# Altium schematic sheet Amplifiers.SchDoc
size A4; SheetNumber: 4; SheetTotal: 4
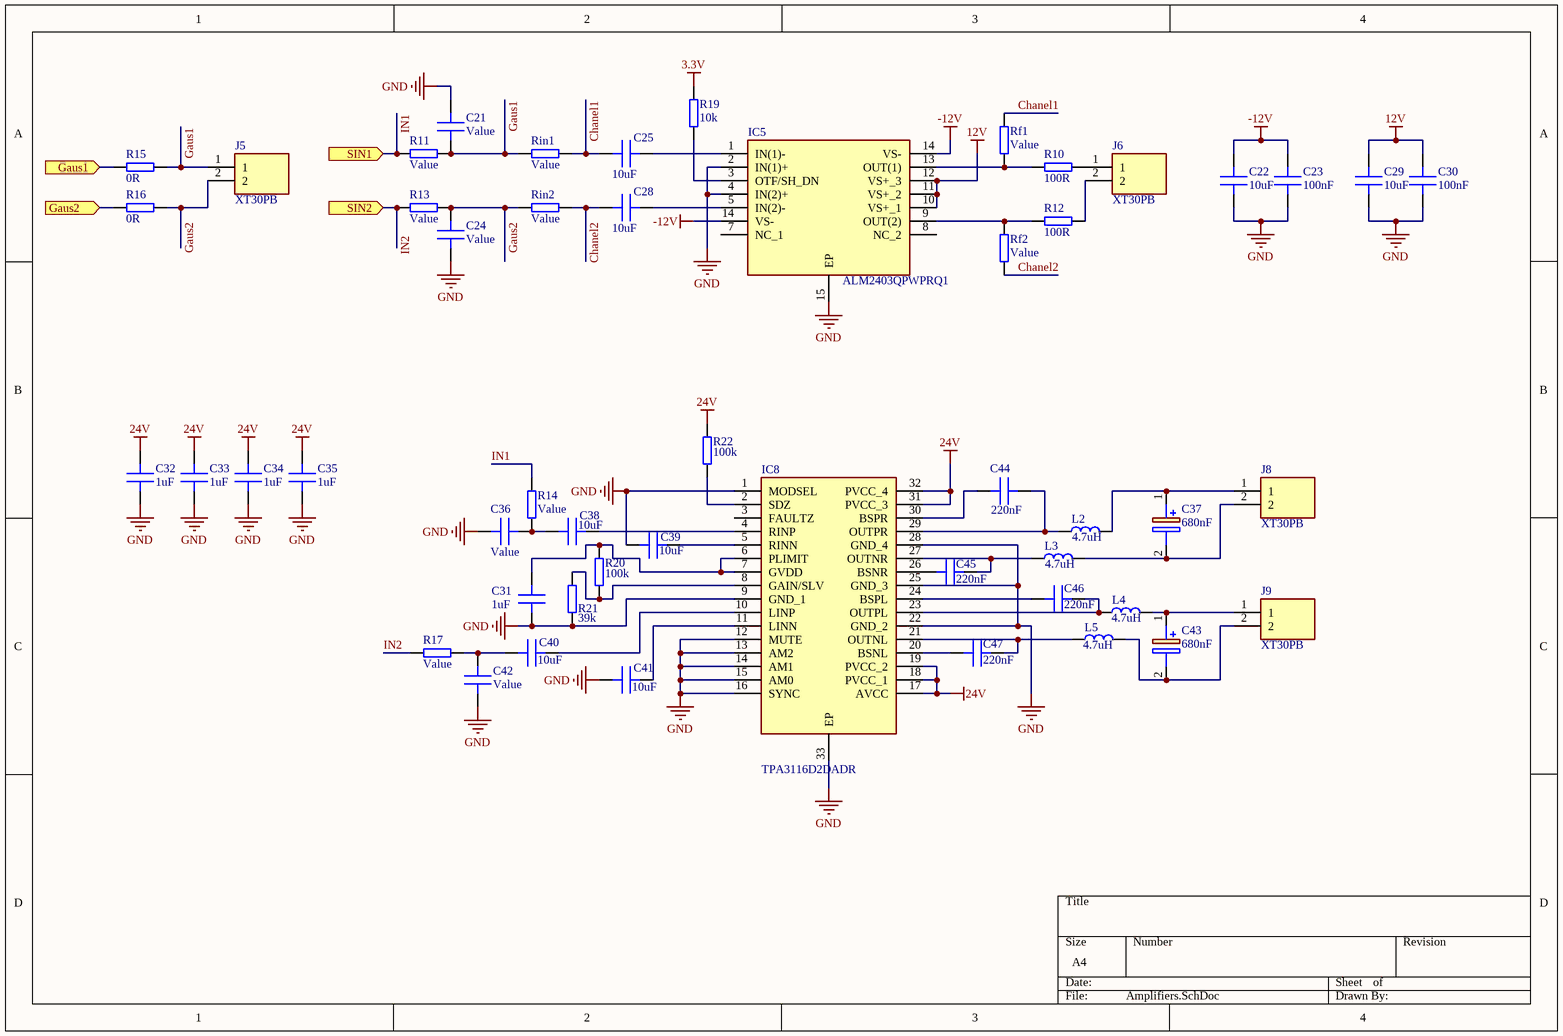
[diagram p0: Amplifiers.SchDoc]

## Parts
C21  Value  [C 0402]
C22  10uF  [C 0805]
C23  100nF  [C 0805]
C24  Value  [C 0402]
C25  10uF  [C 0805]
C28  10uF  [C 0805]
C29  10uF  [C 0805]
C30  100nF  [C 0805]
C31  1uF  [C 0402]
C32  1uF  [C 0603]
C33  1uF  [C 0603]
C34  1uF  [C 0603]
C35  1uF  [C 0603]
C36  Value  [C 0402]
C37  680nF  [CAPPRD250W50D655H1250]
C38  10uF  [C 0805]
C39  10uF  [C 0402]
C40  10uF  [C 0805]
C41  10uF  [C 0402]
C42  Value  [C 0402]
C43  680nF  [CAPPRD250W50D655H1250]
C44  220nF  [C 0402]
C45  220nF  [C 0402]
C46  220nF  [C 0402]
C47  220nF  [C 0402]
IC5  ALM2403QPWPRQ1  [SOP65P640X120-15N]
IC8  TPA3116D2DADR  [SOP65P810X120-33N]
J5  XT30PB  [XT30PB]
J6  XT30PB  [XT30PB]
J8  XT30PB  [XT30PB]
J9  XT30PB  [XT30PB]
L2  4.7uH  [HPI0630]
L3  4.7uH  [HPI0630]
L4  4.7uH  [HPI0630]
L5  4.7uH  [HPI0630]
R10  100R  [R 1206]
R11  Value  [R 0402]
R12  100R  [R 1206]
R13  Value  [R 0402]
R14  Value  [R 0402]
R15  0R  [R 0402]
R16  0R  [R 0402]
R17  Value  [R 0402]
R19  10k  [R 0402]
R20  100k  [R 0402]
R21  39k  [R 0402]
R22  100k  [R 0402]
Rf1  Value  [R 0402]
Rf2  Value  [R 0402]
Rin1  Value  [R 0402]
Rin2  Value  [R 0402]

## Ports
Gaus1 (in), Gaus2 (in), SIN1 (in), SIN2 (in)

## Nets
3.3V: R19.1
12V: C29.1 C30.1 IC5.10(VS+_1) IC5.11(VS+_2) IC5.12(VS+_3)
24V: C32.1 C33.1 C34.1 C35.1 IC8.17(AVCC) IC8.18(PVCC_1) IC8.19(PVCC_2) IC8.31(PVCC_3) IC8.32(PVCC_4) R22.2
-12V: C22.1 C23.1 IC5.14(VS-)
GND: C21.1 C22.2 C23.2 C24.2 C29.2 C30.2 C31.1 C32.2 C33.2 C34.2 C35.2 C36.1 C39.1 C41.1 C42.1 IC5.2(IN(1)+) IC5.4(IN(2)+) IC5.15(EP) IC8.1(MODSEL) IC8.9(GND_1) IC8.12(MUTE) IC8.13(AM2) IC8.14(AM1) IC8.15(AM0) IC8.16(SYNC) IC8.22(GND_2) IC8.25(GND_3) IC8.28(GND_4) IC8.33(EP) R21.1
Chanel1: C25.1 Rf1.2 Rin1.2
Chanel2: C28.1 Rf2.2 Rin2.2
Gaus1: C21.2 J5.1 R11.2 R15.2 Rin1.1
Gaus1: R15.1 ; port Gaus1  [a separate net that carries the same name]
Gaus2: C24.1 J5.2 R13.2 R16.2 Rin2.1
Gaus2: R16.1 ; port Gaus2  [a separate net that carries the same name]
IN1: R11.1 R14.1 ; port SIN1
IN2: R13.1 R17.2 ; port SIN2
NetC25_2: C25.2 IC5.1(IN(1)-)
NetC28_2: C28.2 IC5.5(IN(2)-)
NetC31_2: C31.2 IC8.6(PLIMIT) IC8.7(GVDD) R20.2
NetC36_2: C36.2 C38.1 R14.2
NetC37_1: C37.1(+) J8.1 L2.2
NetC37_2: C37.2(-) J8.2 L3.2
NetC38_2: C38.2 IC8.4(RINP)
NetC39_2: C39.2 IC8.5(RINN)
NetC40_1: C40.1 C42.2 R17.1
NetC40_2: C40.2 IC8.10(LINP)
NetC41_2: C41.2 IC8.11(LINN)
NetC43_1: C43.1(+) J9.1 L4.2
NetC43_2: C43.2(-) J9.2 L5.2
NetC44_1: C44.1 IC8.30(BSPR)
NetC44_2: C44.2 IC8.29(OUTPR) L2.1
NetC45_1: C45.1 IC8.26(BSNR)
NetC45_2: C45.2 IC8.27(OUTNR) L3.1
NetC46_1: C46.1 IC8.24(BSPL)
NetC46_2: C46.2 IC8.23(OUTPL) L4.1
NetC47_1: C47.1 IC8.20(BSNL)
NetC47_2: C47.2 IC8.21(OUTNL) L5.1
NetIC5_3: IC5.3(OTF/SH_DN) R19.2
NetIC5_9: IC5.9(OUT(2)) R12.2 Rf2.1
NetIC5_13: IC5.13(OUT(1)) R10.2 Rf1.1
NetIC8_2: IC8.2(SDZ) R22.1
NetIC8_8: IC8.8(GAIN/SLV) R20.1 R21.2
NetJ6_1: J6.1 R10.1
NetJ6_2: J6.2 R12.1

Not connected (* = marked no-connect by the designer): IC5 7(NC_1) 8(NC_2); IC8 3(FAULTZ)

## Library data of the parts
C21-C25 C28-C36 C38-C42 C44-C47 = Capacitor: MLCC Capacitor
C37 C43 = UVY1V101MED1TD: Capacitor Polarised; Manufacturer_Name: Nichicon; Datasheet Link: http://nichicon-us.com/english/products/pdfs/e-uvy.pdf; Height: 12.5mm; Manufacturer_Part_Number: UVY1V101MED1TD; Arrow Part Number: UVY1V101MED1TD; Arrow Price/Stock: https://www.arrow.com/en/products/uvy1v101med1td/nichicon
IC5 = ALM2403QPWPRQ1: Integrated Circuit; Manufacturer_Name: Texas Instruments; Datasheet Link: https://www.ti.com/lit/ds/symlink/alm2403-q1.pdf?ts=1609171403376&ref_url=https%253A%252F%252Fwww.mouser.de%252F; Height: 1.2mm; Manufacturer_Part_Number: ALM2403QPWPRQ1; Mouser Part Number: 595-ALM2403QPWPRQ1; Mouser Price/Stock: https://www.mouser.co.uk/ProductDetail/Texas-Instruments/ALM2403QPWPRQ1?qs=KUoIvG%2F9IlbGB6vKF5Gy0A%3D%3D; Arrow Part Number: ALM2403QPWPRQ1; Arrow Price/Stock: https://www.arrow.com/en/products/alm2403qpwprq1/texas-instruments?region=nac
IC8 = TPA3116D2DADR: Integrated Circuit; Manufacturer_Name: Texas Instruments; Datasheet Link: http://www.ti.com/lit/gpn/tpa3116d2; Height: 1.2mm; Manufacturer_Part_Number: TPA3116D2DADR; Mouser Part Number: 595-TPA3116D2DADR; Mouser Price/Stock: https://www.mouser.co.uk/ProductDetail/Texas-Instruments/TPA3116D2DADR?qs=3AcK5DacLbpIP1YDOj0hAg%3D%3D; Arrow Part Number: TPA3116D2DADR; Arrow Price/Stock: https://www.arrow.com/en/products/tpa3116d2dadr/texas-instruments?utm_currency=USD&region=nac
J5 J6 J8 J9 = XT30PB: Connector; Manufacturer_Name: Amass; Datasheet Link: https://www.tme.eu/Document/4acc913878197f8c2e30d4b8cdc47230/XT30UPB%20SPEC.pdf; Height: 10.7mm; Manufacturer_Part_Number: XT30PB
L2-L5 = Inductor: General pourpouse inductor
R10-R17 R19-R22 Rf1 Rf2 Rin1 Rin2 = Resistor: General pourpouse resistor